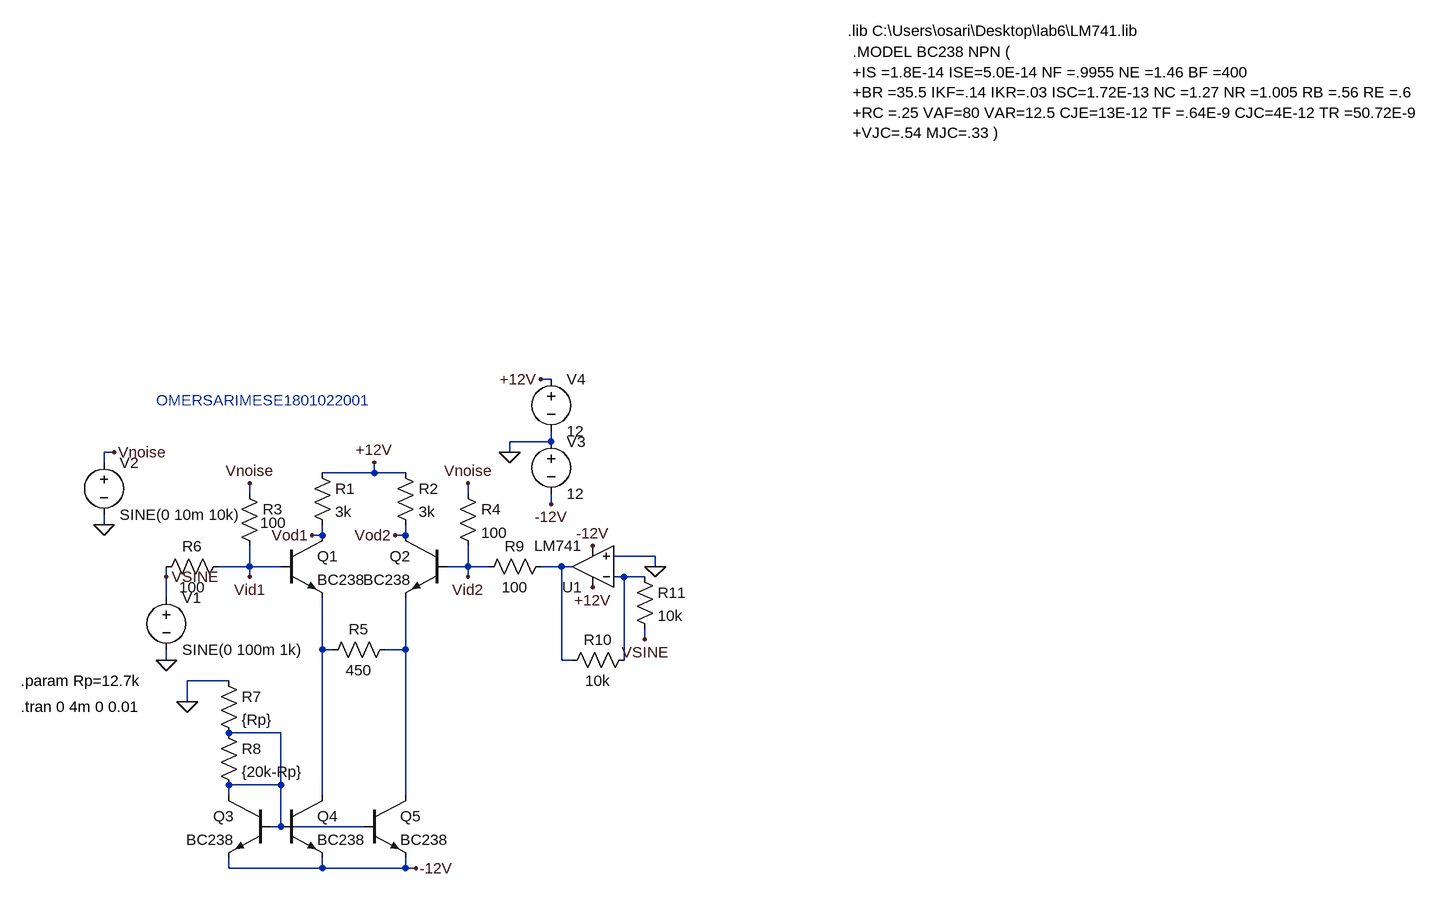
[diagram p0: schematic Draft1.asc]
Draft1.asc, the LTspice schematic file:
Version 4
SHEET 1 1216 1260
WIRE -192 448 -208 448
WIRE -192 544 -192 528
WIRE -192 544 -256 544
WIRE -864 560 -880 560
WIRE -256 560 -256 544
WIRE -880 576 -880 560
WIRE -464 592 -464 576
WIRE -464 592 -544 592
WIRE -416 592 -464 592
WIRE -656 624 -656 608
WIRE -320 624 -320 608
WIRE -192 640 -192 624
WIRE -880 672 -880 656
WIRE -544 688 -544 672
WIRE -544 688 -560 688
WIRE -416 688 -416 672
WIRE -416 688 -432 688
WIRE -32 720 -96 720
WIRE -656 736 -656 704
WIRE -656 736 -704 736
WIRE -608 736 -656 736
WIRE -320 736 -320 704
WIRE -320 736 -352 736
WIRE -288 736 -320 736
WIRE -176 736 -208 736
WIRE -160 736 -176 736
WIRE -32 736 -32 720
WIRE -784 752 -784 736
WIRE -656 752 -656 736
WIRE -320 752 -320 736
WIRE -80 752 -96 752
WIRE -48 752 -80 752
WIRE -784 784 -784 752
WIRE -48 848 -48 832
WIRE -544 864 -544 784
WIRE -528 864 -544 864
WIRE -416 864 -416 784
WIRE -416 864 -448 864
WIRE -784 880 -784 864
WIRE -176 880 -176 736
WIRE -160 880 -176 880
WIRE -80 880 -80 752
WIRE -688 912 -752 912
WIRE -752 944 -752 912
WIRE -608 992 -688 992
WIRE -608 1072 -608 992
WIRE -608 1072 -688 1072
WIRE -688 1088 -688 1072
WIRE -544 1088 -544 864
WIRE -416 1088 -416 864
WIRE -608 1136 -608 1072
WIRE -608 1136 -624 1136
WIRE -480 1136 -608 1136
WIRE -688 1200 -688 1184
WIRE -544 1200 -544 1184
WIRE -544 1200 -688 1200
WIRE -416 1200 -416 1184
WIRE -416 1200 -544 1200
WIRE -400 1200 -416 1200
FLAG -560 688 Vod1
FLAG -432 688 Vod2
FLAG -784 880 0
FLAG -656 608 Vnoise
FLAG -320 608 Vnoise
FLAG -464 576 +12V
FLAG -128 768 +12V
FLAG -128 704 -12V
FLAG -784 752 VSINE
FLAG -48 848 VSINE
FLAG -32 736 0
FLAG -880 672 0
FLAG -864 560 Vnoise
FLAG -256 560 0
FLAG -208 448 +12V
FLAG -192 640 -12V
FLAG -656 752 Vid1
FLAG -320 752 Vid2
FLAG -752 944 0
FLAG -400 1200 -12V
SYMBOL npn -608 688 R0
SYMATTR InstName Q1
SYMATTR Value BC238
SYMBOL npn -352 688 M0
SYMATTR InstName Q2
SYMATTR Value BC238
SYMBOL res -560 576 R0
SYMATTR InstName R1
SYMATTR Value 3k
SYMBOL res -432 576 R0
SYMATTR InstName R2
SYMATTR Value 3k
SYMBOL res -672 608 R0
WINDOW 3 32 61 Left 2
SYMATTR InstName R3
SYMATTR Value 100
SYMBOL res -336 608 R0
SYMATTR InstName R4
SYMATTR Value 100
SYMBOL res -432 848 R90
WINDOW 0 0 56 VBottom 2
WINDOW 3 32 56 VTop 2
SYMATTR InstName R5
SYMATTR Value 450
SYMBOL res -688 720 R90
WINDOW 0 0 56 VBottom 2
WINDOW 3 32 56 VTop 2
SYMATTR InstName R6
SYMATTR Value 100
SYMBOL voltage -784 768 R0
WINDOW 123 0 0 Left 0
WINDOW 39 0 0 Left 0
SYMATTR InstName V1
SYMATTR Value SINE(0 100m 1k)
SYMBOL res -192 720 R90
WINDOW 0 0 56 VBottom 2
WINDOW 3 32 56 VTop 2
SYMATTR InstName R9
SYMATTR Value 100
SYMBOL OpAmps\\opamp2 -128 800 R180
SYMATTR InstName U1
SYMATTR Value LM741
SYMBOL res -64 864 R90
WINDOW 0 0 56 VBottom 2
WINDOW 3 32 56 VTop 2
SYMATTR InstName R10
SYMATTR Value 10k
SYMBOL res -64 736 R0
SYMATTR InstName R11
SYMATTR Value 10k
SYMBOL voltage -880 560 R0
WINDOW 123 0 0 Left 0
WINDOW 39 0 0 Left 0
SYMATTR InstName V2
SYMATTR Value SINE(0 10m 10k)
SYMBOL voltage -192 528 R0
WINDOW 123 0 0 Left 0
WINDOW 39 0 0 Left 0
SYMATTR InstName V3
SYMATTR Value 12
SYMBOL voltage -192 432 R0
WINDOW 123 0 0 Left 0
WINDOW 39 0 0 Left 0
SYMATTR InstName V4
SYMATTR Value 12
SYMBOL npn -624 1088 M0
SYMATTR InstName Q3
SYMATTR Value BC238
SYMBOL res -704 896 R0
SYMATTR InstName R7
SYMATTR Value {Rp}
SYMBOL res -704 976 R0
SYMATTR InstName R8
SYMATTR Value {20k-Rp}
SYMBOL npn -608 1088 R0
SYMATTR InstName Q4
SYMATTR Value BC238
SYMBOL npn -480 1088 R0
SYMATTR InstName Q5
SYMATTR Value BC238
TEXT 272 -56 Left 2 !.MODEL BC238 NPN (\n+IS =1.8E-14 ISE=5.0E-14 NF =.9955 NE =1.46 BF =400\n+BR =35.5 IKF=.14 IKR=.03 ISC=1.72E-13 NC =1.27 NR =1.005 RB =.56 RE =.6\n+RC =.25 VAF=80 VAR=12.5 CJE=13E-12 TF =.64E-9 CJC=4E-12 TR =50.72E-9\n+VJC=.54 MJC=.33 )
TEXT 264 -88 Left 2 !.lib C:\\Users\\osari\\Desktop\\lab6\\LM741.lib
TEXT -800 480 Left 2 ;OMERSARIMESE1801022001
TEXT -1008 912 Left 2 !.param Rp=12.7k
TEXT -1008 952 Left 2 !.tran 0 4m 0 0.01

The netlist it stands for:
* Draft1.asc
Q1 Vod1 Vid1 N003 0 BC238
Q2 Vod2 Vid2 N004 0 BC238
R1 +12V Vod1 3k
R2 +12V Vod2 3k
R3 Vnoise Vid1 100
R4 Vnoise Vid2 100
R5 N004 N003 450
R6 Vid1 VSINE 100
V1 VSINE 0 SINE(0 100m 1k)
R9 N001 Vid2 100
XU1 0 N002 +12V -12V N001 LM741  ; pins In+ In- V+ V- OUT
R10 N002 N001 10k
R11 N002 VSINE 10k
V2 Vnoise 0 SINE(0 10m 10k)
V3 0 -12V 12
V4 +12V 0 12
Q3 N005 N005 -12V 0 BC238
R7 0 N005 {Rp}
R8 N005 N005 {20k-Rp}
Q4 N003 N005 -12V 0 BC238
Q5 N004 N005 -12V 0 BC238
.model NPN NPN
.model PNP PNP
.lib standard.bjt
.MODEL BC238 NPN (
+IS =1.8E-14 ISE=5.0E-14 NF =.9955 NE =1.46 BF =400
+BR =35.5 IKF=.14 IKR=.03 ISC=1.72E-13 NC =1.27 NR =1.005 RB =.56 RE =.6
+RC =.25 VAF=80 VAR=12.5 CJE=13E-12 TF =.64E-9 CJC=4E-12 TR =50.72E-9
+VJC=.54 MJC=.33 )
.lib C:\Users\osari\Desktop\lab6\LM741.lib
* OMERSARIMESE1801022001
.param Rp=12.7k
.tran 0 4m 0 0.01
.backanno
.end